# EAGLE board x0_logic_v0001 (EAGLE 8.0.0)
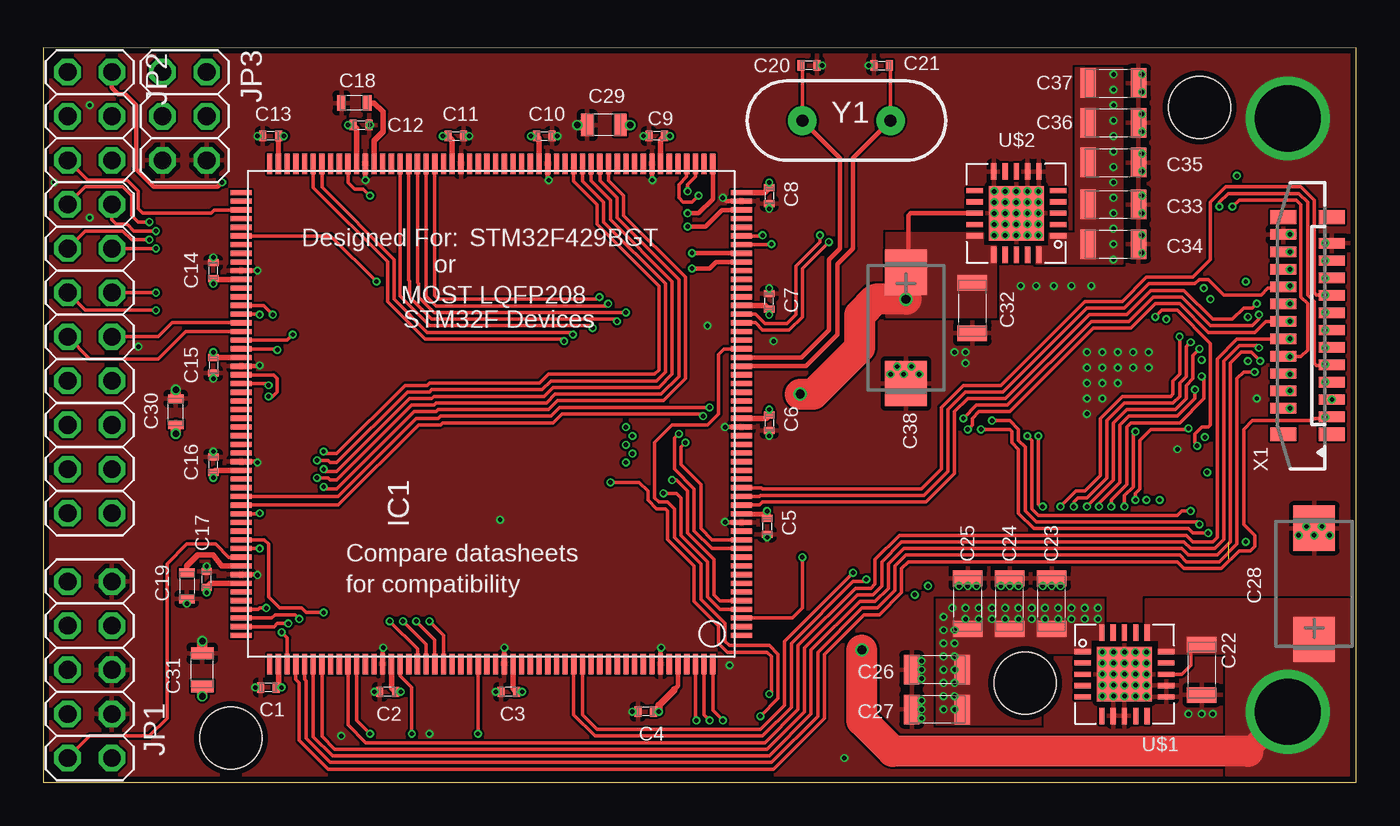
[diagram p7: board, top side]
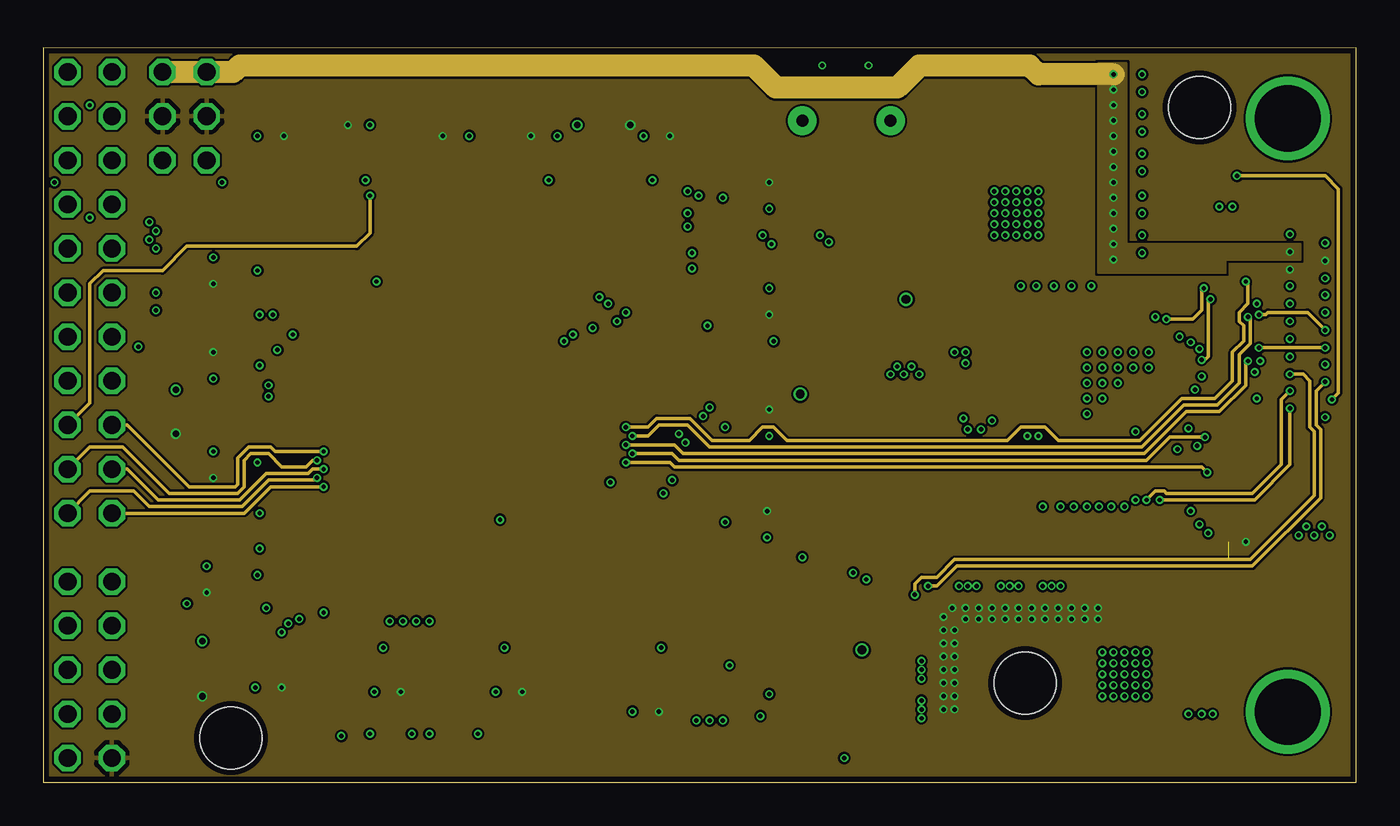
[diagram p8: board, inner layer Route2]
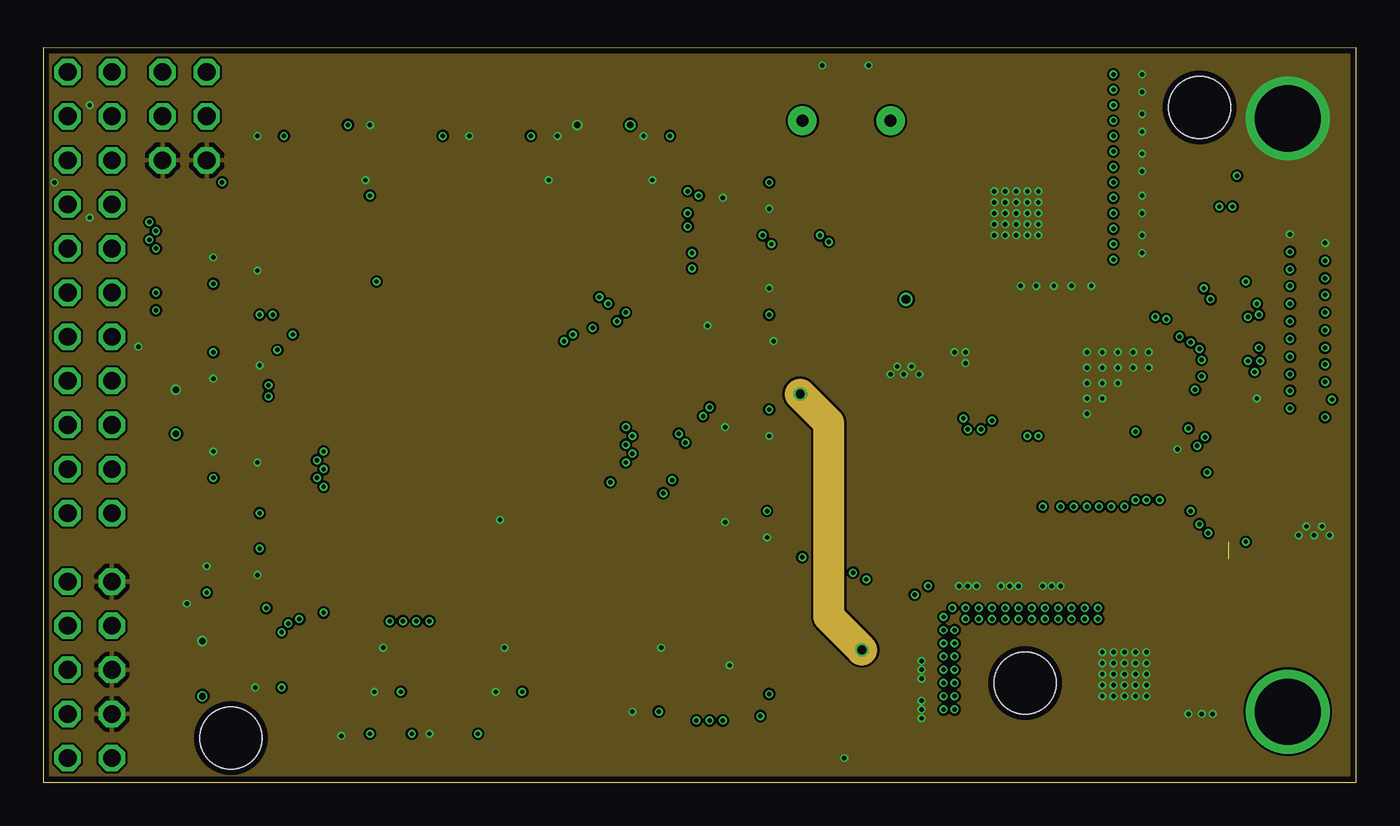
[diagram p9: board, inner layer Route3]
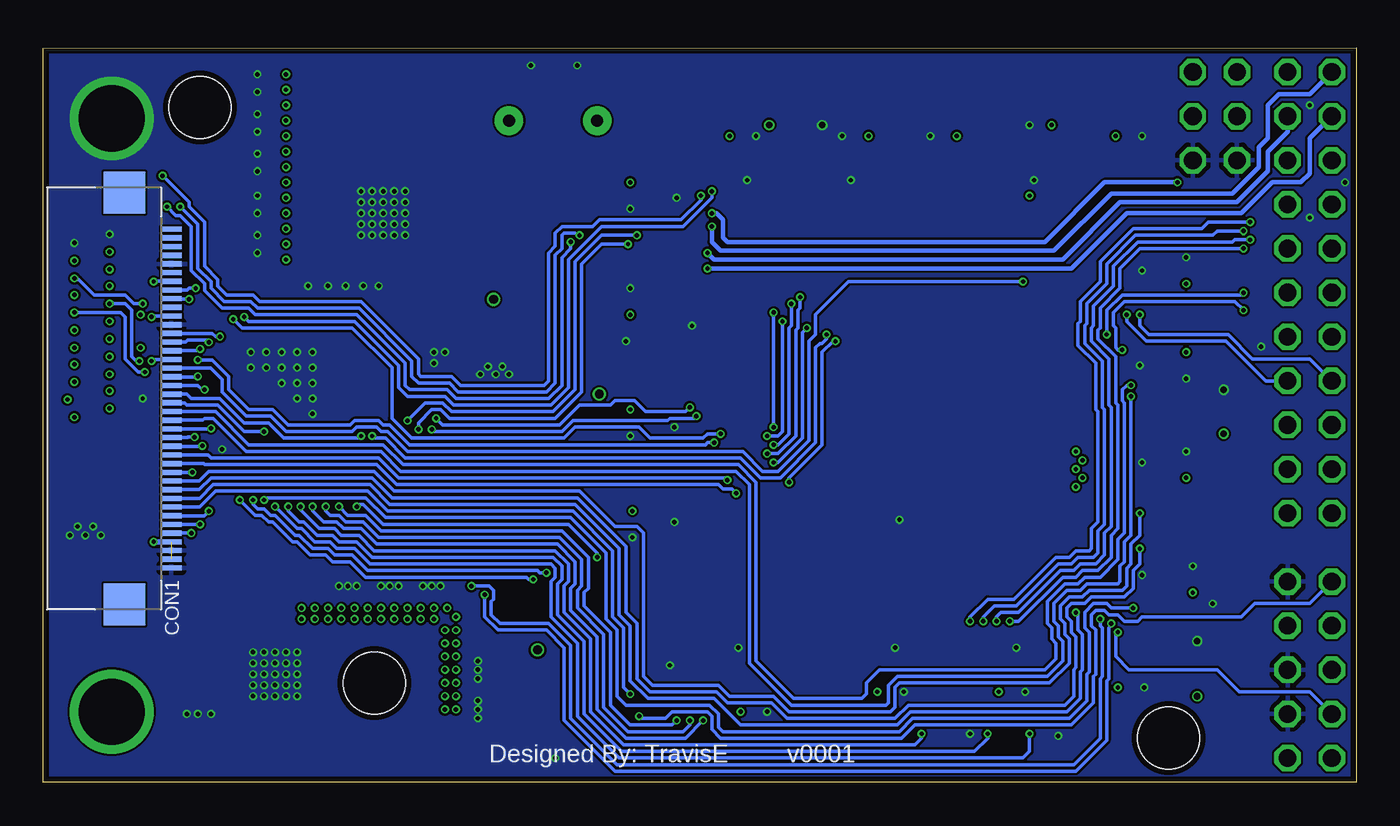
[diagram p10: board, bottom side, seen from below]

Size 75.56 x 42.29 mm. Coordinates in mm from the lower left corner, seen from the top.
Outline: 75.56,0 75.56,42.27 0,42.29 0,0 75.56,0
Copper layers (1*2*3*16): Top 0.035mm / dielectric 1.5mm / Route2 0.035mm / dielectric 0.15mm / Route3 0.035mm / dielectric 0.2mm / Bottom 0.035mm
Design rules "osh_park_4-layer *": minimum track width 5mil, minimum drill 10mil, track to track 5mil, track to pad 5mil, pad to pad 5mil, via to via 5mil, smd to smd 0mil, copper to edge 13mil, drill to drill 8mil, minimum pad ring 4mil, minimum via ring 4mil, stop-mask expansion 4mil, vias tented up to drill 30mil, thermal gap 10mil
Net classes: 1 portj: width 0.203 mm, drill 0.254 mm, clearance 0.127 mm to class 0, clearance 0.127 mm
Holes 3.56 mm at 10.79,2.54 66.55,38.86 56.52,5.71

## Footprints (pad centres in the part's own frame; a part is rotated, then mirrored left to right if it is on the bottom)
0402L3 = smd 0.4 x 0.6: P$1 -0.45,0; P$2 0.45,0
0603L3 = smd 0.5 x 0.9: P$1 -0.75,0; P$2 0.75,0
1206L3 = smd 0.9 x 1.7: 1 -1.45,0; 2 1.45,0
CT7343 = smd 2.6 x 2.4: + -3.2,0; - 3.2,0
0805L3 = smd 0.7 x 1.3: 1 -0.95,0; 2 0.95,0
FPC-40 = smd 0.3 x 1.2: 1 9.75,0; 2 9.25,0; 3 8.75,0; 4 8.25,0; 5 7.75,0; 6 7.25,0; 7 6.75,0; 8 6.25,0; 9 5.75,0; 10 5.25,0; 11 4.75,0; 12 4.25,0; 13 3.75,0; 14 3.25,0; 15 2.75,0; 16 2.25,0; 17 1.75,0; 18 1.25,0; 19 0.75,0; 20 0.25,0; 21 -0.25,0; 22 -0.75,0; 23 -1.25,0; 24 -1.75,0; 25 -2.25,0; 26 -2.75,0; 27 -3.25,0; 28 -3.75,0; 29 -4.25,0; 30 -4.75,0; 31 -5.25,0; 32 -5.75,0; 33 -6.25,0; 34 -6.75,0; 35 -7.25,0; 36 -7.75,0; 37 -8.25,0; 38 -8.75,0; 39 -9.25,0; 40 -9.75,0 | smd 2.4 x 2.4: NAIL@1 -11.85,-2.7; NAIL@2 11.85,-2.7
LQFP208 = smd 0.3 x 1.2: 1 -12.75,-14.4; 2 -12.25,-14.4; 3 -11.75,-14.4; 4 -11.25,-14.4; 5 -10.75,-14.4; 6 -10.25,-14.4; 7 -9.75,-14.4; 8 -9.25,-14.4; 9 -8.75,-14.4; 10 -8.25,-14.4; 11 -7.75,-14.4; 12 -7.25,-14.4; 13 -6.75,-14.4; 14 -6.25,-14.4; 15 -5.75,-14.4; 16 -5.25,-14.4; 17 -4.75,-14.4; 18 -4.25,-14.4; 19 -3.75,-14.4; 20 -3.25,-14.4; 21 -2.75,-14.4; 22 -2.25,-14.4; 23 -1.75,-14.4; 24 -1.25,-14.4; 25 -0.75,-14.4; 26 -0.25,-14.4; 27 0.25,-14.4; 28 0.75,-14.4; 29 1.25,-14.4; 30 1.75,-14.4; 31 2.25,-14.4; 32 2.75,-14.4; 33 3.25,-14.4; 34 3.75,-14.4; 35 4.25,-14.4; 36 4.75,-14.4; 37 5.25,-14.4; 38 5.75,-14.4; 39 6.25,-14.4; 40 6.75,-14.4; 41 7.25,-14.4; 42 7.75,-14.4; 43 8.25,-14.4; 44 8.75,-14.4; 45 9.25,-14.4; 46 9.75,-14.4; 47 10.25,-14.4; 48 10.75,-14.4; 49 11.25,-14.4; 50 11.75,-14.4; 51 12.25,-14.4; 52 12.75,-14.4; 105 12.75,14.4; 106 12.25,14.4; 107 11.75,14.4; 108 11.25,14.4; 109 10.75,14.4; 110 10.25,14.4; 111 9.75,14.4; 112 9.25,14.4; 113 8.75,14.4; 114 8.25,14.4; 115 7.75,14.4; 116 7.25,14.4; 117 6.75,14.4; 118 6.25,14.4; 119 5.75,14.4; 120 5.25,14.4; 121 4.75,14.4; 122 4.25,14.4; 123 3.75,14.4; 124 3.25,14.4; 125 2.75,14.4; 126 2.25,14.4; 127 1.75,14.4; 128 1.25,14.4; 129 0.75,14.4; 130 0.25,14.4; 131 -0.25,14.4; 132 -0.75,14.4; 133 -1.25,14.4; 134 -1.75,14.4; 135 -2.25,14.4; 136 -2.75,14.4; 137 -3.25,14.4; 138 -3.75,14.4; 139 -4.25,14.4; 140 -4.75,14.4; 141 -5.25,14.4; 142 -5.75,14.4; 143 -6.25,14.4; 144 -6.75,14.4; 145 -7.25,14.4; 146 -7.75,14.4; 147 -8.25,14.4; 148 -8.75,14.4; 149 -9.25,14.4; 150 -9.75,14.4; 151 -10.25,14.4; 152 -10.75,14.4; 153 -11.25,14.4; 154 -11.75,14.4; 155 -12.25,14.4; 156 -12.75,14.4 | smd 1.2 x 0.3: 53 14.4,-12.75; 54 14.4,-12.25; 55 14.4,-11.75; 56 14.4,-11.25; 57 14.4,-10.75; 58 14.4,-10.25; 59 14.4,-9.75; 60 14.4,-9.25; 61 14.4,-8.75; 62 14.4,-8.25; 63 14.4,-7.75; 64 14.4,-7.25; 65 14.4,-6.75; 66 14.4,-6.25; 67 14.4,-5.75; 68 14.4,-5.25; 69 14.4,-4.75; 70 14.4,-4.25; 71 14.4,-3.75; 72 14.4,-3.25; 73 14.4,-2.75; 74 14.4,-2.25; 75 14.4,-1.75; 76 14.4,-1.25; 77 14.4,-0.75; 78 14.4,-0.25; 79 14.4,0.25; 80 14.4,0.75; 81 14.4,1.25; 82 14.4,1.75; 83 14.4,2.25; 84 14.4,2.75; 85 14.4,3.25; 86 14.4,3.75; 87 14.4,4.25; 88 14.4,4.75; 89 14.4,5.25; 90 14.4,5.75; 91 14.4,6.25; 92 14.4,6.75; 93 14.4,7.25; 94 14.4,7.75; 95 14.4,8.25; 96 14.4,8.75; 97 14.4,9.25; 98 14.4,9.75; 99 14.4,10.25; 100 14.4,10.75; 101 14.4,11.25; 102 14.4,11.75; 103 14.4,12.25; 104 14.4,12.75; 157 -14.4,12.75; 158 -14.4,12.25; 159 -14.4,11.75; 160 -14.4,11.25; 161 -14.4,10.75; 162 -14.4,10.25; 163 -14.4,9.75; 164 -14.4,9.25; 165 -14.4,8.75; 166 -14.4,8.25; 167 -14.4,7.75; 168 -14.4,7.25; 169 -14.4,6.75; 170 -14.4,6.25; 171 -14.4,5.75; 172 -14.4,5.25; 173 -14.4,4.75; 174 -14.4,4.25; 175 -14.4,3.75; 176 -14.4,3.25; 177 -14.4,2.75; 178 -14.4,2.25; 179 -14.4,1.75; 180 -14.4,1.25; 181 -14.4,0.75; 182 -14.4,0.25; 183 -14.4,-0.25; 184 -14.4,-0.75; 185 -14.4,-1.25; 186 -14.4,-1.75; 187 -14.4,-2.25; 188 -14.4,-2.75; 189 -14.4,-3.25; 190 -14.4,-3.75; 191 -14.4,-4.25; 192 -14.4,-4.75; 193 -14.4,-5.25; 194 -14.4,-5.75; 195 -14.4,-6.25; 196 -14.4,-6.75; 197 -14.4,-7.25; 198 -14.4,-7.75; 199 -14.4,-8.25; 200 -14.4,-8.75; 201 -14.4,-9.25; 202 -14.4,-9.75; 203 -14.4,-10.25; 204 -14.4,-10.75; 205 -14.4,-11.25; 206 -14.4,-11.75; 207 -14.4,-12.25; 208 -14.4,-12.75
2X05 = drill 1.016 octagon: 1 -5.08,-1.27; 2 -5.08,1.27; 3 -2.54,-1.27; 4 -2.54,1.27; 5 0,-1.27; 6 0,1.27; 7 2.54,-1.27; 8 2.54,1.27; 9 5.08,-1.27; 10 5.08,1.27
2X11 = drill 1.016 octagon: 1 -12.7,-1.27; 2 -12.7,1.27; 3 -10.16,-1.27; 4 -10.16,1.27; 5 -7.62,-1.27; 6 -7.62,1.27; 7 -5.08,-1.27; 8 -5.08,1.27; 9 -2.54,-1.27; 10 -2.54,1.27; 11 0,-1.27; 12 0,1.27; 13 2.54,-1.27; 14 2.54,1.27; 15 5.08,-1.27; 16 5.08,1.27; 17 7.62,-1.27; 18 7.62,1.27; 19 10.16,-1.27; 20 10.16,1.27; 21 12.7,-1.27; 22 12.7,1.27
2X03 = drill 1.016 octagon: 1 -2.54,-1.27; 2 -2.54,1.27; 3 0,-1.27; 4 0,1.27; 5 2.54,-1.27; 6 2.54,1.27
POWER-SUPPLY_POS_V1_TI_LDO_VQFN-20 = smd 0.3 x 0.95: 1 -1.3,-2.4; 2 -0.65,-2.4; 3 0,-2.4; 4 0.65,-2.4; 5 1.3,-2.4; 11 1.3,2.4; 12 0.65,2.4; 13 0,2.4; 14 -0.65,2.4; 15 -1.3,2.4 | smd 0.95 x 0.3: 6 2.4,-1.3; 7 2.4,-0.65; 8 2.4,0; 9 2.4,0.65; 10 2.4,1.3; 16 -2.4,1.3; 17 -2.4,0.65; 18 -2.4,0; 19 -2.4,-0.65; 20 -2.4,-1.3 | smd 3.15 x 3.15: TP 0,0
52559-2290 = smd 0.6 x 1.5: 1 -5.25,-1.4; 2 -4.75,1.4; 3 -4.25,-1.4; 4 -3.75,1.4; 5 -3.25,-1.4; 6 -2.75,1.4; 7 -2.25,-1.4; 8 -1.75,1.4; 9 -1.25,-1.4; 10 -0.75,1.4; 11 -0.25,-1.4; 12 0.25,1.4; 13 0.75,-1.4; 14 1.25,1.4; 15 1.75,-1.4; 16 2.25,1.4; 17 2.75,-1.4; 18 3.25,1.4; 19 3.75,-1.4; 20 4.25,1.4; 21 4.75,-1.4; 22 5.25,1.4 | smd 0.8 x 1.5: M1 -6.25,-1.4; M2 6.25,-1.4; M3 6.25,1.4; M4 -6.25,1.4
HC49US = drill 0.7 pad 1.651: 1 -2.54,0; 2 2.54,0

## Placement (x,y rotation side)
C1  100n  [0402L3]  12.95,5.46 180 top
C2  100n  [0402L3]  19.81,5.21 180 top
C3  100n  [0402L3]  26.8,5.21 180 top
C4  100n  [0402L3]  34.67,4.06 180 top
C5  100n  [0402L3]  41.66,14.73 270 top
C6  100n  [0402L3]  41.78,20.7 270 top
C7  100n  [0402L3]  41.78,27.69 90 top
C8  100n  [0402L3]  41.78,33.78 270 top
C9  100n  [0402L3]  35.31,37.21 180 top
C10  100n  [0402L3]  28.83,37.21 0 top
C11  100n  [0402L3]  23.75,37.21 0 top
C12  100n  [0402L3]  18.29,37.85 0 top
C13  100n  [0402L3]  13.08,37.21 180 top
C14  100n  [0402L3]  9.78,29.46 90 top
C15  100n  [0402L3]  9.78,24 270 top
C16  100n  [0402L3]  9.78,18.29 90 top
C17  100n  [0402L3]  9.4,11.68 90 top
C18  2.2u  [0603L3]  17.91,39.12 180 top
C19  2.2u  [0603L3]  8.26,11.3 270 top
C20  22p  [0402L3]  44.07,41.27 180 top
C21  22p  [0402L3]  48.26,41.27 0 top
C22  10u  [1206L3]  66.67,6.48 270 top
C23  10u  [1206L3]  58.04,10.29 90 top
C24  10u  [1206L3]  55.63,10.29 90 top
C25  10u  [1206L3]  53.21,10.29 90 top
C26  10u  [1206L3]  51.44,6.48 180 top
C27  10u  [1206L3]  51.44,4.19 180 top
C28  47u  [CT7343]  73.15,11.43 90 top
C29  1u  [0805L3]  32.26,37.85 180 top
C30  10n  [0603L3]  7.62,21.34 90 top
C31  4.7u  [0805L3]  9.14,6.48 90 top
C32  10u  [1206L3]  53.47,27.3 270 top
C33  10u  [1206L3]  61.59,33.27 0 top
C34  10u  [1206L3]  61.59,30.99 0 top
C35  10u  [1206L3]  61.59,35.69 0 top
C36  10u  [1206L3]  61.59,37.97 0 top
C37  10u  [1206L3]  61.59,40.26 0 top
C38  47u  [CT7343]  49.66,26.16 270 top
CON1  [FPC-40]  68.2,22.1 270 bottom
IC1  STM32F429BGT  [LQFP208]  25.78,21.21 90 top
JP1  [2X05]  2.67,6.48 90 top
JP2  [2X11]  2.67,28.19 90 top
JP3  [2X03]  8.13,38.35 270 top
U$1  POWER-SUPPLY_POS_V1_TI_LDO_TPS7A4700  [POWER-SUPPLY_POS_V1_TI_LDO_VQFN-20]  62.23,6.22 270 top
U$2  POWER-SUPPLY_POS_V1_TI_LDO_TPS7A4700  [POWER-SUPPLY_POS_V1_TI_LDO_VQFN-20]  56.01,32.77 90 top
X1  52559-2290  [52559-2290]  72.77,26.29 90 top
Y1  25MHz  [HC49US]  46.23,38.1 0 top

## Tracks (layer width: path | path; a pad name or v marks a point on that pad's centre or on a via)
5V  (via drill 0.25)
  Top 0.292: X1.20 v71.75,30.54
  Route2 1.27: v61.59,40.77 57.28,40.77 56.77,41.27 50.42,41.27 49.15,40.01 42.16,40.01 40.89,41.27 11.3,41.27 10.92,40.89 JP3.2 JP3.1
  other vias: 61.59,30.1 61.59,30.99 61.59,31.88 61.59,32.77 61.59,33.66 61.59,34.54 61.59,35.43 61.59,36.32 61.59,37.21 61.59,38.1 61.59,38.99 61.59,39.88
  pour Route2: 62.36,41.4 60.71,41.4 60.71,29.34 68.07,29.34 68.07,30.1 72.39,30.1 72.39,30.99 62.36,30.99
  pour Top (no thermals): 57.91,31.62 59.44,31.62 59.44,41.15 62.1,41.15 62.1,29.84 57.15,29.84 57.15,30.86 57.91,30.86
ADC12_IN4  (via drill 0.25)
  Top 0.254: IC1.53 38.53,33.58 37.72,32.77 v37.08,32.77 | JP2.21 3.94,40.01 4.32,39.62 4.7,39.62 5.33,38.99 5.33,35.31 6.35,34.29 10.03,34.29 v10.29,34.54
  Bottom 0.254: v37.08,32.77 36.83,32.77 36.45,32.38 36.45,31.37 36.2,31.11 17.91,31.11 14.48,34.54 v10.29,34.54
ADC123_IN1  (via drill 0.25)
  Top 0.203: IC1.44 39.89,29.96 39.88,29.97
  Top 0.254: IC1.44 38.72,29.96 38.35,29.59 v37.34,29.59
  Bottom 0.254: JP2.20 2.67,37.08 2.67,35.05 3.17,34.54 4.83,34.54 6.6,32.77 13.21,32.77 16.38,29.59 v37.34,29.59
ADC123_IN2  (via drill 0.25)
  Top 0.254: IC1.45 39.9,30.46 39.88,30.48 v37.34,30.48
  Bottom 0.254: v37.34,30.48 36.96,30.1 16.89,30.1 13.59,33.4 6.86,33.4 5.08,35.18 5.08,36.32 3.94,37.47 JP2.19
ADC123_IN3  (via drill 0.25)
  Top 0.254: IC1.50 39.05,32.96 38.1,32 v37.08,32
  Bottom 0.254: v37.08,32 37.08,31.11 36.58,30.61 17.4,30.61 14.1,33.91 7.11,33.91 5.59,35.43 5.59,36.58 5.08,37.08 5.08,38.99 4.45,39.62 2.67,39.62 JP2.22
BATT+  (via drill 0.51, 3.81)
  Top 0.203: U$1.13 65.53,6.22 66.04,6.73 66.04,8.13 66.47,8.13 C22.1
  Top 0.254: v49.66,27.81 49.78,27.94 49.78,32.64 49.91,32.77 U$2.13
  Top 1.27: v71.63,4.06 69.34,1.78 | 49.78,29.49 C38.+
  Top 1.778: v47.12,7.62 47.12,3.56 48.9,1.78 69.34,1.78 | v43.56,22.35 44.32,22.35 46.99,25.02 46.99,26.92 47.88,27.81 v49.66,27.81
  Route3 1.778: v47.12,7.62 45.21,9.53 45.21,20.7 v43.56,22.35
  pour Top (no thermals): 64.2,7.43 68.07,7.43 68.07,0.38 75.18,0.38 75.18,10.54 63.44,10.54 63.44,8.19 64.2,8.19
  pour Top (no thermals): 54.1,31.62 48.51,31.62 48.51,26.8 54.86,26.8 54.86,30.86 54.1,30.86
GND  (via drill 0.25, 0.38, 3.81)
  Top 0.254: IC1.72 29.03,34.72 v29.08,34.67 | IC1.60 35.03,34.69 v35.05,34.67 | IC1.25 39.26,20.46 v39.24,20.45 | IC1.14 39.27,14.96 v39.24,14.99 | IC1.202 35.53,7.72 v35.56,7.75 | IC1.184 26.53,7.74 v26.54,7.75 | IC1.170 19.53,7.72 v19.56,7.75 | IC1.149 12.3,11.96 v12.32,11.94 | IC1.136 12.28,18.46 v12.32,18.41 | IC1.125 12.4,23.96 v12.45,24 | IC1.114 v12.31,29.46 v12.32,29.46 | IC1.93 18.53,34.68 v18.54,34.67 | IC1.51 39.31,33.46 v39.12,33.66
  Top 0.406: C7.P$2 v41.78,28.45 | C20.P$1 v44.83,41.27 | C21.P$1 v47.5,41.27 | C8.P$2 v41.78,33.02 | C6.P$2 v41.78,19.94 | C5.P$2 v41.66,14.1 | C4.P$2 v33.91,4.06 | C3.P$2 v26.04,5.21 | C2.P$2 v19.05,5.21 | C1.P$2 v12.19,5.46 | C17.P$2 v9.4,12.45 | C16.P$2 v9.78,19.05 | C15.P$2 v9.78,23.24 | C14.P$2 v9.78,30.23 | C13.P$2 v12.32,37.21 | C11.P$2 v24.51,37.21 | C10.P$2 v29.59,37.21 | C9.P$2 v34.54,37.21
  Top 0.61: C29.2 v30.73,37.85 | C30.P$2 v7.62,22.61 | C31.2 v9.14,8.13
  other vias: 18.8,37.85 8.26,10.29 71.63,38.23 26.29,15.11 52.7,11.3 53.21,11.3 53.72,11.3 55.12,11.3 55.63,11.3 56.13,11.3 57.53,11.3 58.04,11.3 58.55,11.3 60.07,24.77 50.55,6.99 50.55,6.48 50.55,5.97 50.55,4.7 50.55,4.19 50.55,3.68 62.23,6.22 62.23,7.49 63.5,7.49 60.96,7.49 61.59,7.49 62.87,7.49 60.96,6.86 60.96,6.22 61.59,6.22 62.87,6.22 63.5,6.22 61.59,6.86 62.23,6.86 62.87,6.86 63.5,6.86 60.96,5.59 60.96,4.95 61.59,5.59 62.23,5.59 62.87,5.59 63.5,5.59 61.59,4.95 62.23,4.95 62.87,4.95 63.5,4.95 60.96,24.77 61.85,24.77 62.74,24.77 63.63,24.77 60.07,23.88 60.96,23.88 61.85,23.88 62.74,23.88 63.63,23.88 56.26,28.57 58.17,28.57 57.15,28.57 59.18,28.57 60.33,28.57 60.07,22.99 60.96,22.99 61.85,22.99 60.07,22.1 60.96,22.1 60.07,21.21 71.75,31.56 73.79,31.05 54.74,34.04 55.37,34.04 56.01,34.04 56.64,34.04 57.28,34.04 54.74,33.4 54.74,32.77 54.74,32.13 54.74,31.5 55.37,31.5 56.01,31.5 56.64,31.5 57.28,31.5 57.28,32.13 57.28,32.77 57.28,33.4 55.37,33.4 56.01,33.4 56.64,33.4 55.37,32.77 56.01,32.77 56.64,32.77 55.37,32.13 56.01,32.13 56.64,32.13 48.77,23.5 50.42,23.5 49.53,23.5 49.15,23.94 49.97,23.94 72.26,14.22 73.15,14.22 74.04,14.22 72.71,14.73 73.6,14.73 63.25,40.77 63.25,39.75 63.25,38.48 63.25,37.47 63.25,36.2 63.25,35.18 63.25,33.78 63.25,32.77 63.25,31.5 63.25,30.48 66.67,3.94 65.91,3.94 67.31,3.94 52.45,24.77 53.09,24.77 53.09,24.13 42.04,25.4 38.23,26.29 17.14,2.67 22.23,2.79 46.1,1.4 39.5,6.73 2.67,32.51 2.67,38.99 65.28,19.18 69.85,22.1 5.46,25.08 0.64,34.54
  pour Top (rank 6): 0,0 0,42.93 76.45,42.93 76.45,0
  pour Bottom (rank 6): 0,44.83 78.74,44.83 78.74,0 0,0
  pour Route3: 0,44.2 77.98,44.2 77.98,0 0,0
I2C2_SCL  (via drill 0.25)
  Top 0.203: v71.75,28.57 71.72,28.54 X1.16 71.28,28.45 70.48,28.45 70.1,28.07 67.94,28.07 67.06,28.96 66.55,28.96 66.29,28.7 63.63,28.7 62.23,27.3 60.07,27.3 55.24,22.48 53.09,22.48 52.07,21.46 52.07,17.91 50.67,16.51 41.27,16.51 41.22,16.46 IC1.17
I2C2_SDA  (via drill 0.25)
  Top 0.203: v73.79,28.07 73.81,28.04 X1.15 74.14,28.07 73.28,28.07 73.15,28.19 73.15,33.53 72.39,34.29 68.07,34.29 67.18,33.4 67.18,30.1 66.17,29.08 63.5,29.08 62.1,27.69 59.94,27.69 55.12,22.86 52.96,22.86 51.69,21.59 51.69,18.03 50.55,16.89 41.4,16.89 41.33,16.96 IC1.18
I2C2_SMBA  (via drill 0.25)
  Top 0.203: X1.17 73.81,29.04 v73.79,29.02 | IC1.16 41.23,15.96 41.4,16.13 50.8,16.13 52.45,17.78 52.45,21.34 53.21,22.1 55.37,22.1 60.2,26.92 62.36,26.92 63.75,28.32 65.66,28.32 67.31,26.67 68.45,26.67 69.09,27.3 69.6,27.3 v69.85,27.56
  Bottom 0.203: v69.85,27.56 70.36,27.56 70.87,28.07 72.64,28.07 73.53,28.96 73.72,28.96 v73.79,29.02
N$1
  Top 0.318: IC1.92 19.03,36.94 19.56,37.47 19.56,38.61 19.05,39.12 C18.P$1
N$2
  Top 0.318: IC1.148 10.27,12.46 9.78,13.08 8.89,13.08 8.26,12.45 C19.P$1
N$3
  Top 0.203: Y1.1 43.69,41.21 C20.P$2
  Top 0.254: IC1.33 43.64,24.46 45.21,26.04 45.21,30.1 45.85,30.73 45.85,35.94 Y1.1
N$4
  Top 0.203: C21.P$2 48.77,41.22 Y1.2
  Top 0.254: Y1.2 46.61,35.94 46.61,30.73 45.72,29.84 45.72,25.78 43.9,23.96 IC1.32
PB15
  Top 0.203: IC1.107 9.84,32.96 9.84,32.95 9.65,32.77 5.71,32.77 5.46,33.02 5.46,34.04 4.83,34.67 2.54,34.67 JP2.18
PJ0  (via drill 0.25)
  Top 0.203: IC1.65 32.53,34.65 33.4,33.78 33.4,32.64 36.96,29.08 36.96,23.24 35.69,21.97 29.59,21.97 29.08,21.46 22.73,21.46 22.61,21.34 21.34,21.34 16.89,16.89 16.26,16.89 v16.13,17.02
  Route2 0.203: v16.13,17.02 13.08,17.02 11.56,15.49 JP2.1
PJ1  (via drill 0.25)
  Top 0.203: IC1.66 32.03,34.64 33.02,33.66 33.02,32.51 36.58,28.96 36.58,23.37 35.56,22.35 29.46,22.35 28.96,21.84 22.61,21.84 22.48,21.72 21.21,21.72 16.89,17.4 16.51,17.4 16.38,17.53 v15.75,17.53
  Route2 0.203: v15.75,17.53 15.62,17.4 12.95,17.4 11.43,15.88 6.1,15.88 5.21,16.76 2.67,16.76 JP2.2
PJ2  (via drill 0.25)
  Top 0.203: IC1.67 31.53,34.64 32.64,33.53 32.64,32.38 36.2,28.83 36.2,23.5 35.43,22.73 29.34,22.73 28.83,22.23 22.48,22.23 22.35,22.1 21.08,22.1 16.89,17.91 16.26,17.91 v16.13,18.03
  Route2 0.203: v16.13,18.03 15.49,18.03 15.24,17.78 12.83,17.78 11.3,16.26 6.6,16.26 4.83,18.03 JP2.3
PJ3  (via drill 0.25)
  Top 0.203: IC1.68 31.03,34.63 32.26,33.4 32.26,32.26 35.81,28.7 35.81,23.62 35.31,23.11 29.21,23.11 28.7,22.61 22.35,22.61 22.23,22.48 20.95,22.48 16.89,18.41 16.51,18.41 16.38,18.54 v15.75,18.54
  Route2 0.203: v15.75,18.54 15.49,18.54 15.11,18.16 13.72,18.16 12.95,18.92 11.94,18.92 11.56,18.54 11.56,17.02 11.18,16.64 7.24,16.64 4.57,19.3 2.67,19.3 JP2.4
PJ4  (via drill 0.25)
  Top 0.203: IC1.69 30.53,34.62 31.88,33.27 31.88,32.13 35.43,28.57 35.43,23.75 35.18,23.5 29.08,23.5 28.57,22.99 22.23,22.99 22.1,22.86 20.83,22.86 16.89,18.92 16.26,18.92 v16.13,19.05
  Route2 0.203: v16.13,19.05 13.34,19.05 13.08,19.3 11.81,19.3 11.18,18.67 11.18,17.14 11.05,17.02 8.38,17.02 4.83,20.57 JP2.5
PJ5  (via drill 0.25)
  Top 0.203: IC1.95 17.53,34.54 17.91,34.16 18.41,34.16 v18.8,33.78
  Route2 0.203: v18.8,33.78 18.8,31.62 18.03,30.86 8.26,30.86 6.86,29.46 3.43,29.46 2.67,28.7 2.67,21.84 JP2.6
PJ6  (via drill 0.25)
  Top 0.203: IC1.118 12.67,27.46 v13.21,26.92
  Bottom 0.203: v13.21,26.92 13.21,26.54 12.06,25.4 7.49,25.4 5.21,23.11 JP2.7
PJ7  (via drill 0.25)
  Top 0.203: IC1.119 12.41,26.96 v12.45,26.92
  Bottom 0.203: v12.45,26.92 12.45,26.29 11.94,25.78 7.37,25.78 5.97,24.38 2.67,24.38 JP2.8
PJ8
  Top 0.203: JP2.9 6.6,25.65 7.41,26.46 IC1.120
PJ9
  Top 0.203: JP2.10 2.67,24.38 6.6,24.38 8.18,25.96 IC1.121
PJ10  (via drill 0.25)
  Top 0.203: JP2.11 v6.48,28.19 | IC1.122 14.03,25.46 v14.35,25.78
  Bottom 0.203: v14.35,25.78 14.35,27.18 13.46,28.07 6.6,28.07 v6.48,28.19
PJ11  (via drill 0.25)
  Top 0.203: JP2.12 2.41,27.18 v6.48,27.18 | IC1.123 13.52,24.96 v13.46,24.89
  Bottom 0.203: v6.48,27.18 6.99,27.69 13.34,27.69 13.97,27.05 13.97,26.29 13.84,26.16 13.84,25.02 13.72,24.89 v13.46,24.89
PJ12  (via drill 0.25)
  Top 0.203: IC1.174 21.53,7.68 v19.94,9.27 | JP2.13 v6.48,30.73
  Bottom 0.203: v19.94,9.27 19.43,9.27 16.89,11.81 16.13,11.81 15.75,12.19 14.86,12.19 14.1,12.95 14.1,14.22 13.72,14.61 13.72,21.72 13.84,21.84 13.84,24.51 14.86,25.53 14.86,26.04 14.73,26.16 14.73,27.3 13.59,28.45 13.59,29.59 12.45,30.73 v6.48,30.73
PJ13  (via drill 0.25)
  Top 0.203: JP2.14 2.41,31.75 4.57,31.75 5.08,31.24 v6.1,31.24 | IC1.175 22.03,7.94 v20.7,9.27
  Bottom 0.203: v20.7,9.27 20.7,9.53 20.45,9.78 19.43,9.78 17.02,12.19 16.26,12.19 15.88,12.57 14.99,12.57 14.48,13.08 14.48,14.35 14.1,14.73 14.1,21.59 14.22,21.72 14.22,24.38 15.24,25.4 15.24,26.16 15.11,26.29 15.11,27.43 13.97,28.57 13.97,29.72 12.57,31.11 7.11,31.11 6.99,31.24 v6.1,31.24
PJ14  (via drill 0.25)
  Top 0.203: IC1.176 22.53,8.2 v21.46,9.27 | JP2.15 3.94,32.38 4.19,32.13 4.83,32.13 5.21,31.75 v6.48,31.75
  Bottom 0.203: v21.46,9.27 21.46,9.53 20.83,10.16 19.56,10.16 17.14,12.57 16.38,12.57 16,12.95 15.11,12.95 14.86,13.21 14.86,14.48 14.48,14.86 14.48,21.46 14.61,21.59 14.61,24.26 15.62,25.27 15.62,26.29 15.49,26.42 15.49,27.56 14.35,28.7 14.35,29.84 12.7,31.5 8.26,31.5 8,31.75 v6.48,31.75
PJ15  (via drill 0.25)
  Top 0.203: JP2.16 2.41,34.29 4.57,34.29 5.08,33.78 5.08,32.64 5.46,32.26 v6.1,32.26 | IC1.177 23.03,8.46 v22.23,9.27
  Bottom 0.203: v22.23,9.27 22.23,9.53 21.21,10.54 19.68,10.54 17.27,12.95 16.51,12.95 16.13,13.34 15.37,13.34 15.24,13.46 15.24,14.61 14.86,14.99 14.86,21.34 14.99,21.46 14.99,24.13 16,25.15 16,26.42 15.88,26.54 15.88,27.69 14.73,28.83 14.73,29.97 12.83,31.88 8.89,31.88 8.51,32.26 v6.1,32.26
RESET#  (via drill 0.25)
  Top 0.203: IC1.34 39.18,24.96 38.86,24.64 38.86,21.21 38.23,20.57 36.2,20.57 35.18,19.56 35.18,16.38 35.43,16.13 35.94,16.13 36.32,15.75 36.32,14.1 37.85,12.57 37.85,10.54 39.24,9.14 39.24,8.13 39.5,7.87 41.78,7.87 42.29,7.37 42.29,4.83 v41.27,3.81
  Bottom 0.203: JP1.10 2.67,10.29 5.84,10.29 6.6,9.53 12.32,9.53 12.57,9.27 13.34,9.27 13.72,9.65 14.22,9.65 14.48,9.91 14.99,9.91 15.24,9.65 15.24,9.02 14.99,8.76 14.99,6.22 15.11,6.1 15.11,4.57 16.38,3.3 25.4,3.3 26.16,2.54 36.58,2.54 37.08,3.05 37.08,3.81 37.34,4.06 39.37,4.06 39.75,3.68 41.15,3.68 v41.27,3.81
SDIO_CK  (via drill 0.25)
  Top 0.203: IC1.163 16.03,2.64 16.76,1.91 41.66,1.91 43.81,4.06 43.81,7.75 46.86,10.79 47.75,10.79 48.26,11.3 48.26,12.7 49.4,13.84 65.66,13.84 66.04,13.46 67.44,13.46 67.94,13.97 67.94,24.26 68.83,25.15 69.85,25.15 v69.98,25.02 | X1.9 73.81,25.04 v73.79,25.02
  Route2 0.203: v69.98,25.02 v73.79,25.02
SDIO_CMD  (via drill 0.25)
  Top 0.203: IC1.166 17.53,3.3 18.54,2.29 41.53,2.29 43.43,4.19 43.43,7.87 46.74,11.18 47.62,11.18 47.88,11.43 47.88,12.83 49.28,14.22 65.79,14.22 66.17,13.84 67.31,13.84 67.56,14.1 67.56,24.38 68.71,25.53 71.36,25.53 X1.10 v71.74,25.54 v71.75,25.53
SDIO_D0  (via drill 0.25)
  Top 0.203: X1.11 v73.79,26.04 | IC1.140 16.97,16.46 21.46,20.95 22.73,20.95 22.86,21.08 29.21,21.08 29.72,21.59 v38.35,21.59 | v69.98,26.92 69.98,26.67 69.6,26.29 67.18,26.29 65.53,27.94 63.88,27.94 62.48,26.54 60.33,26.54 55.5,21.72 53.72,21.72 v52.96,20.95
  Route2 0.203: v69.98,26.92 70.36,26.92 70.48,27.05 72.77,27.05 v73.79,26.04
  Bottom 0.203: v52.96,20.95 52.58,20.57 45.85,20.57 44.7,21.72 42.93,21.72 42.67,21.97 41.53,21.97 40.89,21.34 38.61,21.34 v38.35,21.59
SDIO_D1  (via drill 0.25)
  Top 0.203: v71.75,26.54 X1.12 70.35,26.54 69.72,25.91 67.06,25.91 65.41,27.56 64.01,27.56 62.61,26.16 60.45,26.16 55.63,21.34 53.85,21.34 53.47,20.95 53.47,20.57 v53.21,20.32 | IC1.141 16.98,15.96 21.59,20.57 22.86,20.57 22.99,20.7 29.34,20.7 29.84,21.21 37.85,21.21 v37.97,21.08
  Bottom 0.203: v53.21,20.32 53.09,20.19 45.72,20.19 45.09,20.83 39.62,20.83 39.5,20.95 38.1,20.95 v37.97,21.08
SDIO_D2  (via drill 0.25)
  Top 0.203: IC1.161 15.03,5.92 15.11,5.84 15.11,2.54 16.51,1.14 41.91,1.14 44.58,3.81 44.58,7.49 47.12,10.03 48.01,10.03 49.02,11.05 49.02,12.45 49.66,13.08 65.41,13.08 65.79,12.7 67.69,12.7 68.71,13.72 68.71,23.24 69.09,23.62 v69.72,23.62 | X1.13 v73.8,27.04 v73.79,27.05
  Bottom 0.203: v69.72,23.62 70.1,23.62 70.87,24.38 70.87,26.8 71.12,27.05 v73.79,27.05
SDIO_D3  (via drill 0.25)
  Top 0.203: IC1.162 15.53,2.63 16.64,1.52 41.78,1.52 44.2,3.94 44.2,7.62 46.99,10.41 47.88,10.41 48.64,11.18 48.64,12.57 49.53,13.46 65.53,13.46 65.91,13.08 67.56,13.08 68.33,13.84 68.33,24.13 68.96,24.77 69.53,24.77 v70.04,24.26 | X1.14 71.73,27.54 v71.75,27.56
  Bottom 0.203: v70.04,24.26 70.23,24.26 70.48,24.51 70.48,27.18 70.87,27.56 v71.75,27.56
SPI1_CLK  (via drill 0.25)
  Top 0.203: IC1.192 30.53,3.89 31.75,2.67 41.4,2.67 43.05,4.32 43.05,8 46.61,11.56 47.24,11.56 v47.37,11.68 | X1.2 v71.74,21.54 v71.75,21.53
  Route2 0.203: v64.26,16.26 69.72,16.26 71.75,18.29 v71.75,21.53
  Bottom 0.203: v47.37,11.68 47.62,11.68 47.75,11.81 57.02,11.81 57.91,12.7 58.93,12.7 59.31,13.08 60.2,13.08 60.96,13.84 61.21,13.84 62.36,14.99 62.61,14.99 62.99,15.37 63.37,15.37 v64.26,16.26
SPI1_MISO  (via drill 0.25)
  Top 0.203: X1.4 | IC1.193 31.03,3.89 31.88,3.05 41.27,3.05 42.67,4.45 42.67,8.13 v46.61,12.06 | 71.69,22.61 v71.75,22.54
  Top 0.292: X1.4 v71.75,22.54
  Route2 0.203: v63.5,16.26 64.01,16.76 64.52,16.76 64.64,16.64 69.6,16.64 71.25,18.29 71.25,22.04 v71.75,22.54
  Bottom 0.203: v46.61,12.06 46.99,12.06 47.12,12.19 56.9,12.19 57.78,13.08 58.8,13.08 59.18,13.46 60.07,13.46 60.83,14.22 61.09,14.22 62.23,15.37 62.48,15.37 62.87,15.75 63.25,15.75 63.5,16 v63.5,16.26
SPI1_MOSI  (via drill 0.25)
  Top 0.203: X1.3 | IC1.56 37.03,34.87 36.58,34.42 36.58,33.66 36.83,33.4 37.34,33.4 v37.72,33.78
  Route2 0.203: v68.71,34.92 73.79,34.92 74.55,34.16 74.55,22.42 X1.3
  Bottom 0.203: v68.71,34.92 67.18,33.4 67.18,33.15 66.29,32.26 66.29,29.72 65.53,28.96 65.53,28.57 65.02,28.07 63.5,28.07 63.12,27.69 57.28,27.69 53.98,24.38 53.98,23.5 53.85,23.37 52.07,23.37 51.56,22.86 46.74,22.86 46.48,23.11 46.48,30.48 46.1,30.86 46.1,31.62 45.72,32 43.94,32 43.56,32.38 38.86,32.38 37.72,33.53 v37.72,33.78
  other vias: 74.17,22.04
SPI1_NSS  (via drill 0.25)
  Top 0.203: IC1.160 14.53,5.92 14.73,5.71 14.73,2.41 16.38,0.76 42.04,0.76 44.96,3.68 44.96,7.37 47.24,9.65 48.13,9.65 49.4,10.92 49.4,12.32 49.78,12.7 65.28,12.7 65.66,12.32 67.82,12.32 68.83,13.34 69.47,13.34 69.72,13.59 69.72,14.22 69.09,14.86 69.09,20.32 69.6,20.83 73.03,20.83 73.15,20.95 73.72,20.95 v73.79,21.02 73.81,21.04 X1.1
SPI2_CLK  (via drill 0.25)
  Top 0.203: X1.6 71.71,23.54 v71.75,23.5 | v14.1,9.14 13.46,9.14 13.28,8.96 IC1.155
  Route2 0.203: v50.16,10.79 50.16,11.43 50.55,11.81 51.44,11.81 52.45,12.83 69.47,12.83 73.15,16.51 73.15,20.19 72.9,20.45 72.9,23.11 72.52,23.5 v71.75,23.5
  Bottom 0.203: v14.1,9.14 14.1,9.02 14.22,8.89 14.22,5.97 14.35,5.84 14.35,2.41 16.13,0.64 42.67,0.64 45.59,3.56 45.59,7.75 46.61,8.76 49.4,8.76 50.16,9.53 v50.16,10.79
SPI2_MISO  (via drill 0.25)
  Top 0.203: X1.8 71.73,24.54 v71.75,24.51 72.39,24.51 72.77,24.89 72.77,27.56 72.39,27.94 72.39,33.27 72.14,33.53 68.83,33.53 v68.45,33.15 | IC1.37 40.98,26.46 41.4,26.04 42.93,26.04 43.69,26.8 43.69,29.59 v45.21,31.11
  Bottom 0.203: v68.45,33.15 67.94,32.64 67.69,32.64 67.06,32 67.06,29.46 66.29,28.7 66.29,28.32 65.28,27.3 63.75,27.3 63.37,26.92 57.53,26.92 54.74,24.13 54.74,22.86 54.48,22.61 52.32,22.61 51.82,22.1 46.48,22.1 45.72,22.86 45.72,30.23 45.21,30.73 v45.21,31.11
SPI2_MOSI  (via drill 0.25)
  Top 0.203: v73.79,24.07 73.81,24.04 X1.7 74.14,24 73.28,24 73.15,24.13 73.15,27.69 72.77,28.07 72.77,33.4 72.26,33.91 68.2,33.91 67.69,33.4 v67.69,33.15 | IC1.38 40.99,26.96 41.53,26.42 42.8,26.42 43.31,26.92 43.31,29.72 44.7,31.11 v44.7,31.5
  Bottom 0.203: v44.7,31.5 44.83,31.5 44.96,31.62 45.59,31.62 45.72,31.5 45.72,30.73 46.1,30.35 46.1,22.99 46.61,22.48 51.69,22.48 52.2,22.99 53.98,22.99 54.36,23.37 54.36,24.26 57.4,27.3 63.25,27.3 63.63,27.69 65.15,27.69 65.91,28.45 65.91,28.83 66.67,29.59 66.67,32.13 v67.69,33.15
SPI2_NSS  (via drill 0.25)
  Top 0.203: X1.5 v73.8,23.04 v73.79,23.05 | v14.73,9.4 14.48,9.65 13.34,9.65 13.14,9.46 IC1.154
  Route2 0.203: v73.79,23.05 73.28,22.54 73.28,20.57 73.53,20.32 73.53,16.38 69.6,12.45 52.58,12.45 51.44,11.3 v50.93,11.3
  Bottom 0.203: v14.73,9.4 14.73,9.02 14.61,8.89 14.61,6.1 14.73,5.97 14.73,2.54 16.26,1.02 42.55,1.02 45.21,3.68 45.21,7.87 46.48,9.14 49.28,9.14 49.78,9.65 49.78,10.41 49.66,10.54 49.66,11.05 49.91,11.3 v50.93,11.3
SWCLK  (via drill 0.25)
  Top 0.203: IC1.159 14.03,8.32 v13.72,8.64
  Bottom 0.203: JP1.4 2.67,5.21 6.73,5.21 8,6.48 13.08,6.48 13.84,7.24 13.84,8.51 v13.72,8.64
SWDIO
  Top 0.203: IC1.147 10.66,12.96 9.91,13.72 8.26,13.72 7.11,12.57 7.11,3.68 6.1,2.67 2.67,2.67 JP1.2
TFT_B0  (via drill 0.25)
  Top 0.203: IC1.3 43.11,9.46 43.69,10.03 v43.69,12.95 | v57.53,15.88 57.4,15.88 57.28,16 v57.28,19.94
  Bottom 0.203: v57.53,15.88 57.4,16 57.15,16 56.01,14.86 45.34,14.86 43.69,13.21 v43.69,12.95 | CON1.21 67.31,22.35 67.06,22.1 65.41,22.1 64.01,20.7 62.61,20.7 61.72,19.81 57.4,19.81 v57.28,19.94
TFT_B1  (via drill 0.25)
  Top 0.203: v60.77,15.88 60.77,16.07 61.98,17.27 61.98,20.57 62.48,21.08 65.28,21.08 66.29,22.1 v66.29,22.61 | IC1.181 25.03,2.81 v25.02,2.79
  Bottom 0.203: v60.77,15.88 60.77,15.68 59.69,14.61 58.8,14.61 58.42,14.22 57.4,14.22 56.52,13.34 46.1,13.34 45.34,12.57 45.34,11.56 45.59,11.3 45.59,9.78 44.07,8.26 44.07,4.06 42.16,2.16 25.4,2.16 25.02,2.54 v25.02,2.79 | v66.29,22.61 66.42,22.61 66.67,22.86 68.19,22.86 CON1.22
TFT_B2  (via drill 0.25)
  Top 0.203: v61.47,15.88 61.47,16.26 62.36,17.14 62.36,20.45 62.61,20.7 65.41,20.7 66.8,22.1 66.8,23.24 v66.67,23.37 | IC1.172 20.53,6.14 21.21,5.46 v21.21,2.79
  Bottom 0.203: v61.47,15.88 61.47,15.62 60.83,14.99 60.58,14.99 59.82,14.22 58.93,14.22 58.55,13.84 57.53,13.84 56.64,12.95 46.23,12.95 45.72,12.45 45.72,11.68 45.97,11.43 45.97,9.65 44.45,8.13 44.45,3.94 42.29,1.78 21.97,1.78 21.21,2.54 v21.21,2.79 | CON1.23 66.69,23.35 v66.67,23.37
TFT_B3  (via drill 0.25)
  Top 0.203: IC1.110 16.55,31.46 v19.18,28.83
  Bottom 0.203: CON1.24 65.94,23.85 65.28,23.18 65.28,22.48 63.88,21.08 62.48,21.08 61.59,20.19 57.78,20.19 57.53,20.45 56.39,20.45 56.13,20.19 55.75,20.19 54.61,19.05 35.31,19.05 34.16,17.91 33.27,17.91 31.5,19.68 31.5,25.4 31.11,25.78 31.11,26.92 29.21,28.83 v19.18,28.83
TFT_B4  (via drill 0.25)
  Top 0.203: v32.51,27.56 32.38,27.43 22.61,27.43 22.03,28.01 IC1.86
  Route2 0.203: v69.34,24.26 69.22,24.13 69.22,22.86 67.69,21.34 65.79,21.34 63.37,18.92 36.83,18.92 36.32,19.43 v33.53,19.43
  Bottom 0.203: CON1.25 69.25,24.35 v69.34,24.26 | v33.53,19.43 33.27,19.43 32.64,20.07 32.64,26.16 32.51,26.29 v32.51,27.56
TFT_B5  (via drill 0.25)
  Top 0.203: v60.07,15.88 61.59,17.4 61.59,20.7 62.36,21.46 65.15,21.46 65.79,22.1 65.79,22.86 66.17,23.24 66.17,24.57 v66.55,24.96 | IC1.206 37.53,3.62 v37.59,3.56
  Bottom 0.203: v60.07,15.88 60.07,15.62 59.44,14.99 58.67,14.99 58.29,14.61 57.28,14.61 56.39,13.72 45.97,13.72 44.96,12.7 44.96,11.43 45.21,11.18 45.21,9.91 43.69,8.38 43.69,4.19 42.04,2.54 38.61,2.54 v37.59,3.56 | CON1.26 66.66,24.85 v66.55,24.96
TFT_B6  (via drill 0.25)
  Top 0.203: 59.31,16 v59.31,15.88 59.31,16.13 59.56,16.38 60.07,16.38 61.21,17.53 61.21,20.83 62.23,21.84 65.02,21.84 65.41,22.23 65.41,22.99 65.79,23.37 65.79,25.08 v66.04,25.34 | IC1.207 38.03,3.88 v38.35,3.56
  Bottom 0.203: v59.31,15.88 59.31,15.62 59.05,15.37 58.55,15.37 58.17,14.99 57.15,14.99 56.26,14.1 45.85,14.1 44.58,12.83 44.58,11.3 44.83,11.05 44.83,10.03 43.31,8.51 43.31,4.32 41.91,2.92 38.73,2.92 38.35,3.3 v38.35,3.56 | 66.05,25.35 v66.04,25.34 66.17,25.46 67.25,25.46 67.36,25.35 CON1.27
TFT_B7  (via drill 0.25)
  Top 0.203: v58.55,15.88 59.44,16.76 59.94,16.76 60.83,17.65 60.83,20.95 62.1,22.23 64.9,22.23 65.02,22.35 65.02,23.11 65.41,23.5 v65.41,25.65 | IC1.208 38.53,4.14 v39.12,3.56
  Bottom 0.203: CON1.28 65.85,25.85 65.65,25.65 v65.41,25.65 | v58.55,15.88 58.04,15.37 57.02,15.37 56.13,14.48 45.72,14.48 44.2,12.95 44.2,11.18 44.45,10.92 44.45,10.16 42.93,8.64 42.93,4.45 41.78,3.3 39.37,3.3 v39.12,3.56
TFT_CLK  (via drill 0.25)
  Top 0.203: IC1.88 21.03,28.91 21.08,28.85 21.08,27.94 22.35,26.67 32.89,26.67 v33.02,26.54
  Route2 0.203: v69.34,26.8 69.47,26.67 69.47,25.27 68.83,24.64 68.83,22.99 67.56,21.72 65.66,21.72 63.25,19.3 38.35,19.3 37.08,20.57 35.43,20.57 34.8,19.94 v33.91,19.94
  Bottom 0.203: CON1.30 69.29,26.85 v69.34,26.8 | v33.91,19.94 33.27,19.94 33.02,20.19 v33.02,26.54
TFT_DE  (via drill 0.25)
  Top 0.203: IC1.87 21.53,28.77 21.59,28.71 21.59,27.94 22.48,27.05 v33.53,27.05
  Route2 0.203: v69.22,28.83 69.34,28.7 69.34,27.56 68.83,27.05 68.83,26.54 69.09,26.29 69.09,25.4 68.45,24.77 68.45,23.11 67.44,22.1 65.53,22.1 63.12,19.68 58.42,19.68 57.66,20.45 56.26,20.45 55.5,19.68 42.8,19.68 42.04,20.45 41.4,20.45 40.64,19.68 38.48,19.68 37.21,20.95 35.31,20.95 34.8,20.45 v33.53,20.45
  Bottom 0.203: CON1.34 69.2,28.85 v69.22,28.83 | v33.53,27.05 v33.53,20.45
TFT_G0  (via drill 0.25)
  Top 0.203: v35.69,16.64 36.45,16.64 36.7,16.38 36.7,14.22 38.23,12.7 38.23,10.67 38.94,9.96 IC1.4
  Bottom 0.203: v35.69,16.64 35.94,16.89 36.45,16.89 36.7,17.14 55.24,17.14 56.39,18.29 66.29,18.29 66.35,18.35 CON1.13
TFT_G1  (via drill 0.25)
  Top 0.203: IC1.5 38.94,10.46 38.61,10.79 38.61,12.83 37.08,14.35 37.08,16.76 36.45,17.4 v36.2,17.4
  Bottom 0.203: v36.2,17.4 36.32,17.53 55.12,17.53 56.26,18.67 65.91,18.67 66.09,18.85 CON1.14
TFT_G2  (via drill 0.25)
  Top 0.203: v64.01,26.8 64.39,27.18 65.28,27.18 67.18,25.27 67.18,20.57 67.06,20.45 66.67,20.45 66.29,20.07 66.29,19.56 66.42,19.43 v66.42,19.37 | IC1.55 37.53,34.86 37.08,34.42 v37.08,34.04
  Bottom 0.203: CON1.15 66.44,19.35 v66.42,19.37 | v64.01,26.8 63.75,26.54 57.66,26.54 55.12,24 55.12,22.73 54.61,22.23 52.45,22.23 51.94,21.72 46.35,21.72 45.34,22.73 45.34,30.1 43.43,32 38.73,32 37.08,33.66 v37.08,34.04
TFT_G3  (via drill 0.25)
  Top 0.203: v32,27.94 31.88,27.81 22.73,27.81 22.53,28.02 IC1.85
  Route2 0.203: v66.86,19.88 64.83,19.88 63.5,18.54 36.58,18.54 36.2,18.92 v33.91,18.92
  Bottom 0.203: v66.86,19.88 67.25,19.88 67.27,19.85 CON1.16 | v33.91,18.92 33.27,18.92 32.26,19.94 32.26,26.04 32.13,26.16 32.13,27.18 32,27.3 v32,27.94
TFT_G4  (via drill 0.25)
  Top 0.203: v12.83,10.03 12.45,10.03 12.37,9.96 IC1.153 | v62.87,16.26 62.87,16.64 63.12,16.89 63.12,19.68 63.75,20.32 65.85,20.32 v65.91,20.38
  Bottom 0.203: v62.87,16.26 62.74,16.38 57.02,16.38 55.88,15.24 45.21,15.24 43.18,13.21 43.18,9.4 42.55,8.76 42.55,4.95 42.04,4.45 37.21,4.45 36.7,3.94 36.7,3.17 36.45,2.92 26.29,2.92 25.53,3.68 16.51,3.68 15.49,4.7 15.49,6.22 15.37,6.35 15.37,8.64 15.62,8.89 15.62,9.78 15.11,10.29 14.35,10.29 14.1,10.03 v12.83,10.03 | CON1.17 65.95,20.35 v65.91,20.38
TFT_G5  (via drill 0.25)
  Top 0.203: IC1.126 13.24,23.46 13.46,23.24 13.46,22.48 13.21,22.23 v12.95,22.23
  Bottom 0.203: CON1.18 66.4,20.85 66.29,20.95 65.79,20.95 63.88,19.05 56.13,19.05 54.99,17.91 35.69,17.91 34.92,17.14 34.92,6.86 32.51,4.45 27.05,4.45 26.92,4.57 26.92,5.59 26.42,6.1 17.78,6.1 16.89,6.99 16.89,8.13 17.14,8.38 17.14,9.02 17.4,9.27 17.4,10.29 16.64,11.05 15.88,11.05 15.49,11.43 13.72,11.43 13.59,11.56 13.59,12.45 13.34,12.7 13.34,13.84 12.95,14.22 v12.95,22.23
TFT_G6  (via drill 0.25)
  Top 0.203: IC1.127 12.86,22.96 v12.95,22.86
  Bottom 0.203: CON1.19 67.7,21.35 67.69,21.34 65.66,21.34 63.75,19.43 56.01,19.43 54.86,18.29 35.56,18.29 34.54,17.27 34.54,6.99 32.38,4.83 28.45,4.83 28.19,5.08 28.19,5.71 27.43,6.48 17.91,6.48 17.27,7.11 17.27,8 17.53,8.26 17.53,8.89 17.78,9.14 17.78,10.41 16.76,11.43 16,11.43 15.62,11.81 14.73,11.81 13.72,12.83 13.72,13.97 13.34,14.35 13.34,21.84 13.46,21.97 13.46,22.61 13.21,22.86 v12.95,22.86
TFT_G7  (via drill 0.25)
  Top 0.203: v62.23,15.88 62.23,16.51 62.74,17.02 62.74,20.07 v62.87,20.19 | IC1.167 18.03,3.56 v18.8,2.79
  Bottom 0.203: CON1.20 67.44,21.85 67.31,21.72 65.53,21.72 64.01,20.19 v62.87,20.19 | v18.8,2.79 18.8,1.78 19.18,1.4 42.42,1.4 44.83,3.81 44.83,8 46.35,9.53 46.35,11.56 46.1,11.81 46.1,12.32 46.35,12.57 56.77,12.57 57.66,13.46 58.67,13.46 59.05,13.84 59.94,13.84 60.71,14.61 60.96,14.61 v62.23,15.88
TFT_HSYNC  (via drill 0.25)
  Top 0.203: IC1.12 38.49,13.96 37.85,14.61 37.85,17.14 36.7,18.29 36.7,19.3 v36.96,19.56
  Route2 0.203: v67.18,27.81 67.06,27.69 67.06,24.51 66.93,24.38 66.74,24.38 v66.67,24.32
  Bottom 0.203: v36.96,19.56 37.34,19.56 37.47,19.43 54.48,19.43 55.63,20.57 56.01,20.57 56.26,20.83 57.66,20.83 57.91,20.57 61.47,20.57 62.36,21.46 63.75,21.46 64.9,22.61 64.9,23.37 65.85,24.32 v66.67,24.32 | v67.18,27.81 68.16,27.81 CON1.32 | 66.61,24.26 v66.67,24.32 | v66.67,24.32 66.48,24.32
TFT_R0  (via drill 0.25)
  Top 0.203: IC1.46 41.88,30.96 v41.91,30.99 | v67.06,14.35 66.17,14.35 65.91,14.61 57.02,14.61 56.13,15.49 56.13,19.18 55.75,19.56 55.75,20.19 55.63,20.32 v53.98,20.32
  Bottom 0.203: v41.91,30.99 43.43,30.99 44.58,29.84 44.58,22.48 46.1,20.95 52.2,20.95 52.7,21.46 53.21,21.46 53.98,20.7 v53.98,20.32 | v67.06,14.35 CON1.5
TFT_R1  (via drill 0.25)
  Top 0.203: IC1.47 41.37,31.46 v41.4,31.5 | v54.61,20.83 55.63,20.83 56.13,20.32 56.13,19.68 56.52,19.3 56.52,15.62 57.15,14.99 66.42,14.99 v66.55,14.86
  Bottom 0.203: v41.4,31.5 43.43,31.5 44.96,29.97 44.96,22.61 46.23,21.34 52.07,21.34 52.58,21.84 53.59,21.84 v54.61,20.83 | v66.55,14.86 68.19,14.86 CON1.6
TFT_R2  (via drill 0.25)
  Top 0.203: v56.64,19.94 56.9,19.68 56.9,15.75 57.28,15.37 65.28,15.37 65.53,15.62 v66.04,15.62 | v30.48,25.78 30.35,25.91 22.1,25.91 20.19,27.81 20.19,30.1 16.03,34.26 IC1.98
  Bottom 0.203: CON1.7 66.31,15.35 v66.04,15.62 | v56.64,19.94 56.52,19.81 55.88,19.81 54.74,18.67 35.43,18.67 34.29,17.53 33.15,17.53 31.11,19.56 31.11,25.02 30.86,25.27 30.73,25.27 30.48,25.53 v30.48,25.78
TFT_R3  (via drill 0.25)
  Top 0.203: v32.64,17.27 34.29,17.27 34.8,16.76 34.8,16.26 35.31,15.75 35.81,15.75 35.94,15.62 35.94,13.97 37.47,12.45 37.47,10.41 38.86,9.02 38.86,8 39.37,7.49 41.66,7.49 41.91,7.24 41.91,5.21 v41.78,5.08 | IC1.99 15.53,34.25 19.81,29.97 19.81,27.69 21.97,25.53 29.84,25.53 v29.97,25.4
  Bottom 0.203: CON1.8 66.58,15.85 65.66,16.76 56.9,16.76 55.75,15.62 45.09,15.62 42.8,13.34 42.8,9.53 42.16,8.89 42.16,5.46 v41.78,5.08 | v32.64,17.27 32.64,17.53 30.73,19.43 30.73,24.77 30.1,25.4 v29.97,25.4
TFT_R4  (via drill 0.25)
  Top 0.203: IC1.145 12.71,13.96 12.95,13.72 12.95,10.67 13.59,10.03 14.86,10.03 15.11,9.78 v16.13,9.78
  Bottom 0.203: CON1.9 66.58,16.35 65.79,17.14 56.77,17.14 55.63,16 44.96,16 42.42,13.46 42.42,9.65 41.78,9.02 41.78,5.84 40.77,4.83 36.96,4.83 35.43,3.3 26.42,3.3 25.65,4.06 16.64,4.06 15.88,4.83 15.88,6.35 15.75,6.48 15.75,8.51 16,8.76 16,9.65 v16.13,9.78
TFT_R5  (via drill 0.25)
  Top 0.203: IC1.146 v12.44,13.46 v12.45,13.46
  Bottom 0.203: CON1.10 66.59,16.85 65.91,17.53 56.64,17.53 55.5,16.38 44.83,16.38 42.04,13.59 42.04,9.78 41.4,9.14 41.4,5.97 40.64,5.21 36.83,5.21 36.2,4.57 33.66,4.57 32.77,3.68 26.54,3.68 25.78,4.45 16.76,4.45 16.26,4.95 16.26,6.48 16.13,6.6 16.13,8.38 16.38,8.64 16.38,9.27 16.64,9.53 16.64,10.03 16.38,10.29 15.62,10.29 15.24,10.67 13.34,10.67 12.83,11.18 12.83,12.19 12.45,12.57 v12.45,13.46
TFT_R6  (via drill 0.25)
  Top 0.203: IC1.142 12.41,15.46 v12.45,15.49
  Bottom 0.203: CON1.11 66.6,17.35 66.04,17.91 56.52,17.91 55.37,16.76 44.7,16.76 42.67,14.73 41.4,14.73 41.02,14.35 41.02,6.1 40.51,5.59 36.7,5.59 36.07,4.95 33.53,4.95 32.64,4.06 26.8,4.06 26.54,4.32 26.54,5.46 26.29,5.71 17.65,5.71 16.51,6.86 16.51,8.26 16.76,8.51 16.76,9.14 17.02,9.4 17.02,10.16 16.51,10.67 15.75,10.67 15.37,11.05 13.46,11.05 13.21,11.3 13.21,12.32 12.95,12.57 12.95,13.72 12.45,14.22 v12.45,15.49
TFT_R7  (via drill 0.25)
  Top 0.203: v31.62,26.16 31.5,26.29 22.23,26.29 20.53,27.98 IC1.89
  Route2 0.203: v66.99,17.84 66.67,18.16 36.32,18.16 36.07,18.41 v33.53,18.41
  Bottom 0.203: v66.99,17.84 CON1.12 | v33.53,18.41 33.27,18.41 31.88,19.81 31.88,25.91 v31.62,26.16
TFT_VSYNC  (via drill 0.25)
  Top 0.203: IC1.11 38.48,13.46 37.47,14.48 37.47,16.89 36.32,18.03 36.32,19.81 v36.58,20.07
  Route2 0.203: v64.64,26.67 66.17,26.67 66.67,27.18 66.67,28.32 v66.8,28.45
  Bottom 0.203: v36.58,20.07 37.34,20.07 37.59,19.81 40.64,19.81 41.27,20.45 44.96,20.45 45.59,19.81 54.36,19.81 55.5,20.95 55.5,23.88 57.78,26.16 64.14,26.16 v64.64,26.67 | v66.8,28.45 67.18,28.45 67.28,28.35 CON1.33
VDD  (via drill 0.25, 0.38)  (1 unrouted)
  Top 0.254: IC1.204 36.53,5.54 36.32,5.33
  Top 0.292: IC1.103 C13.P$1 | IC1.15 41.49,15.46 v41.66,15.62 | X1.18 v71.74,29.54 v71.75,29.53 | X1.19 v73.79,30.04
  Top 0.318: C6.P$1 41.59,20.96 IC1.26 | C7.P$1 41.56,27.46 IC1.39 | C8.P$1 41.51,33.96 IC1.52 | C9.P$1 35.53,36.99 IC1.59 | C10.P$1 28.53,37.06 IC1.73 | C11.P$1 23.53,36.98 IC1.83 | C12.P$1 18.03,37.65 IC1.94 | C1.P$1 13.53,5.59 IC1.158 | C2.P$1 20.03,5.44 IC1.171 | C3.P$1 27.03,5.42 IC1.185 | 35.13,4.08 C4.P$1 | IC1.115 9.83,28.96 C14.P$1 | IC1.124 C15.P$1 | IC1.137 9.9,17.96 C16.P$1 | IC1.150 9.62,11.46 C17.P$1
  Top 0.406: v41.66,15.62 C5.P$1 | C6.P$1 v41.78,21.46 | C8.P$1 v41.78,34.54 | C9.P$1 v36.07,37.21 | C11.P$1 v22.99,37.21 | C12.P$1 v17.53,37.85 | C13.P$1 v13.84,37.21 | C14.P$1 v9.78,28.7 | C15.P$1 v9.78,24.77 | C16.P$1 v9.78,17.53 | C17.P$1 v9.4,10.92 | C1.P$1 v13.72,5.46 | C2.P$1 v20.57,5.21 | C3.P$1 v27.56,5.21 | C4.P$1 v35.43,4.06 35.43,4.45 36.32,5.33 | C7.P$1 v41.78,26.92 | C10.P$1 v28.07,37.21
  Top 0.61: C29.1 v33.78,37.85 | C30.P$1 v7.62,20.07 | C31.1 v9.14,4.95
  Bottom 0.318: CON1.4 v69.21,13.85 v69.22,13.84
  other vias: 60.71,10.03 59.94,10.03 59.18,10.03 58.42,10.03 57.66,10.03 56.9,10.03 56.13,10.03 55.37,10.03 54.61,10.03 53.85,10.03 53.09,10.03 52.32,10.03 51.82,9.53 51.82,8.76 51.82,8 51.82,7.24 51.82,6.48 51.82,5.71 51.82,4.95 51.82,4.19 60.71,9.4 59.94,9.4 59.18,9.4 58.42,9.4 57.66,9.4 56.9,9.4 56.13,9.4 55.37,9.4 54.61,9.4 53.85,9.4 53.09,9.4 52.45,8.76 52.45,8 52.45,7.24 52.45,6.48 52.45,5.71 52.45,4.95 52.45,4.19
  pour Route2 (rank 6): 0,43.56 77.22,43.56 77.22,0 0,0
  pour Top (no thermals): 60.26,7.43 57.4,7.43 57.4,3.3 51.44,3.3 51.44,10.54 61.02,10.54 61.02,8.19 60.26,8.19

## Text on the board
tPlace: Designed For: | STM32F429BGT | or | MOST LQFP208 | STM32F Devices | Compare datasheets | for compatibility
bPlace: v0001 | Designed By: TravisE